# Altium schematic sheet [03] - LCD TFT.SchDoc: =ProjectName
size A4; CheckedBy: Ven; Author: Ven; CompanyName: HUST; Revision: V.1.0
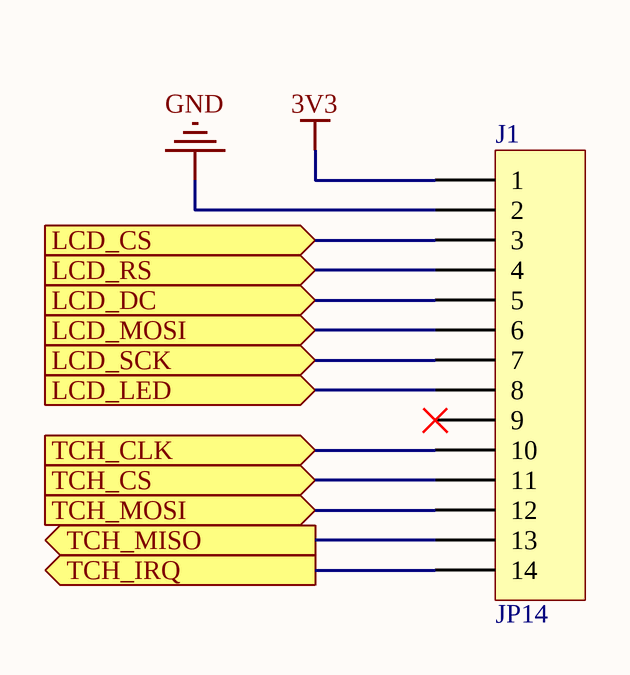
[diagram p0: [03] - LCD TFT.SchDoc]

## Parts
J1  JP14  [JP14-D1T]

## Ports
LCD_CS (in), LCD_DC (in), LCD_LED (in), LCD_MOSI (in), LCD_RS (in), LCD_SCK (in), TCH_CLK (in), TCH_CS (in), TCH_IRQ (out), TCH_MISO (out), TCH_MOSI (in)

## Nets
3V3: J1.1
GND: J1.2
LCD_CS: J1.3 ; port LCD_CS
LCD_DC: J1.5 ; port LCD_DC
LCD_LED: J1.8 ; port LCD_LED
LCD_MOSI: J1.6 ; port LCD_MOSI
LCD_RS: J1.4 ; port LCD_RS
LCD_SCK: J1.7 ; port LCD_SCK
TCH_CLK: J1.10 ; port TCH_CLK
TCH_CS: J1.11 ; port TCH_CS
TCH_IRQ: J1.14 ; port TCH_IRQ
TCH_MISO: J1.13 ; port TCH_MISO
TCH_MOSI: J1.12 ; port TCH_MOSI

Not connected (* = marked no-connect by the designer): J1 9*

## Notes on the sheet
- Project:
- Page Contents:
- Size:
- Date:
- A4
- Checked by:
- Time:
- Revision:
- Sheet
- of
- File:

## Library data of the parts
J1 = JP14: WR-PHD 2.54 mm Angled Socket Header; Manufacturer: W¨¹rth Elektronik eiSos GmbH; partNo: 613014143121; ComponentLink1 Description: Manufacturer; ComponentLink2 Description: Datasheet; NoPins: 14; Created Date: 29 March 2013; ComponentLink1URL: http://www.we-online.com; ComponentLink2URL: http://katalog.we-online.de/em/datasheet/6130xx143121.pdf; Created by: Karrer Zheng